# EAGLE design artProject_X (EAGLE 8.6.0)
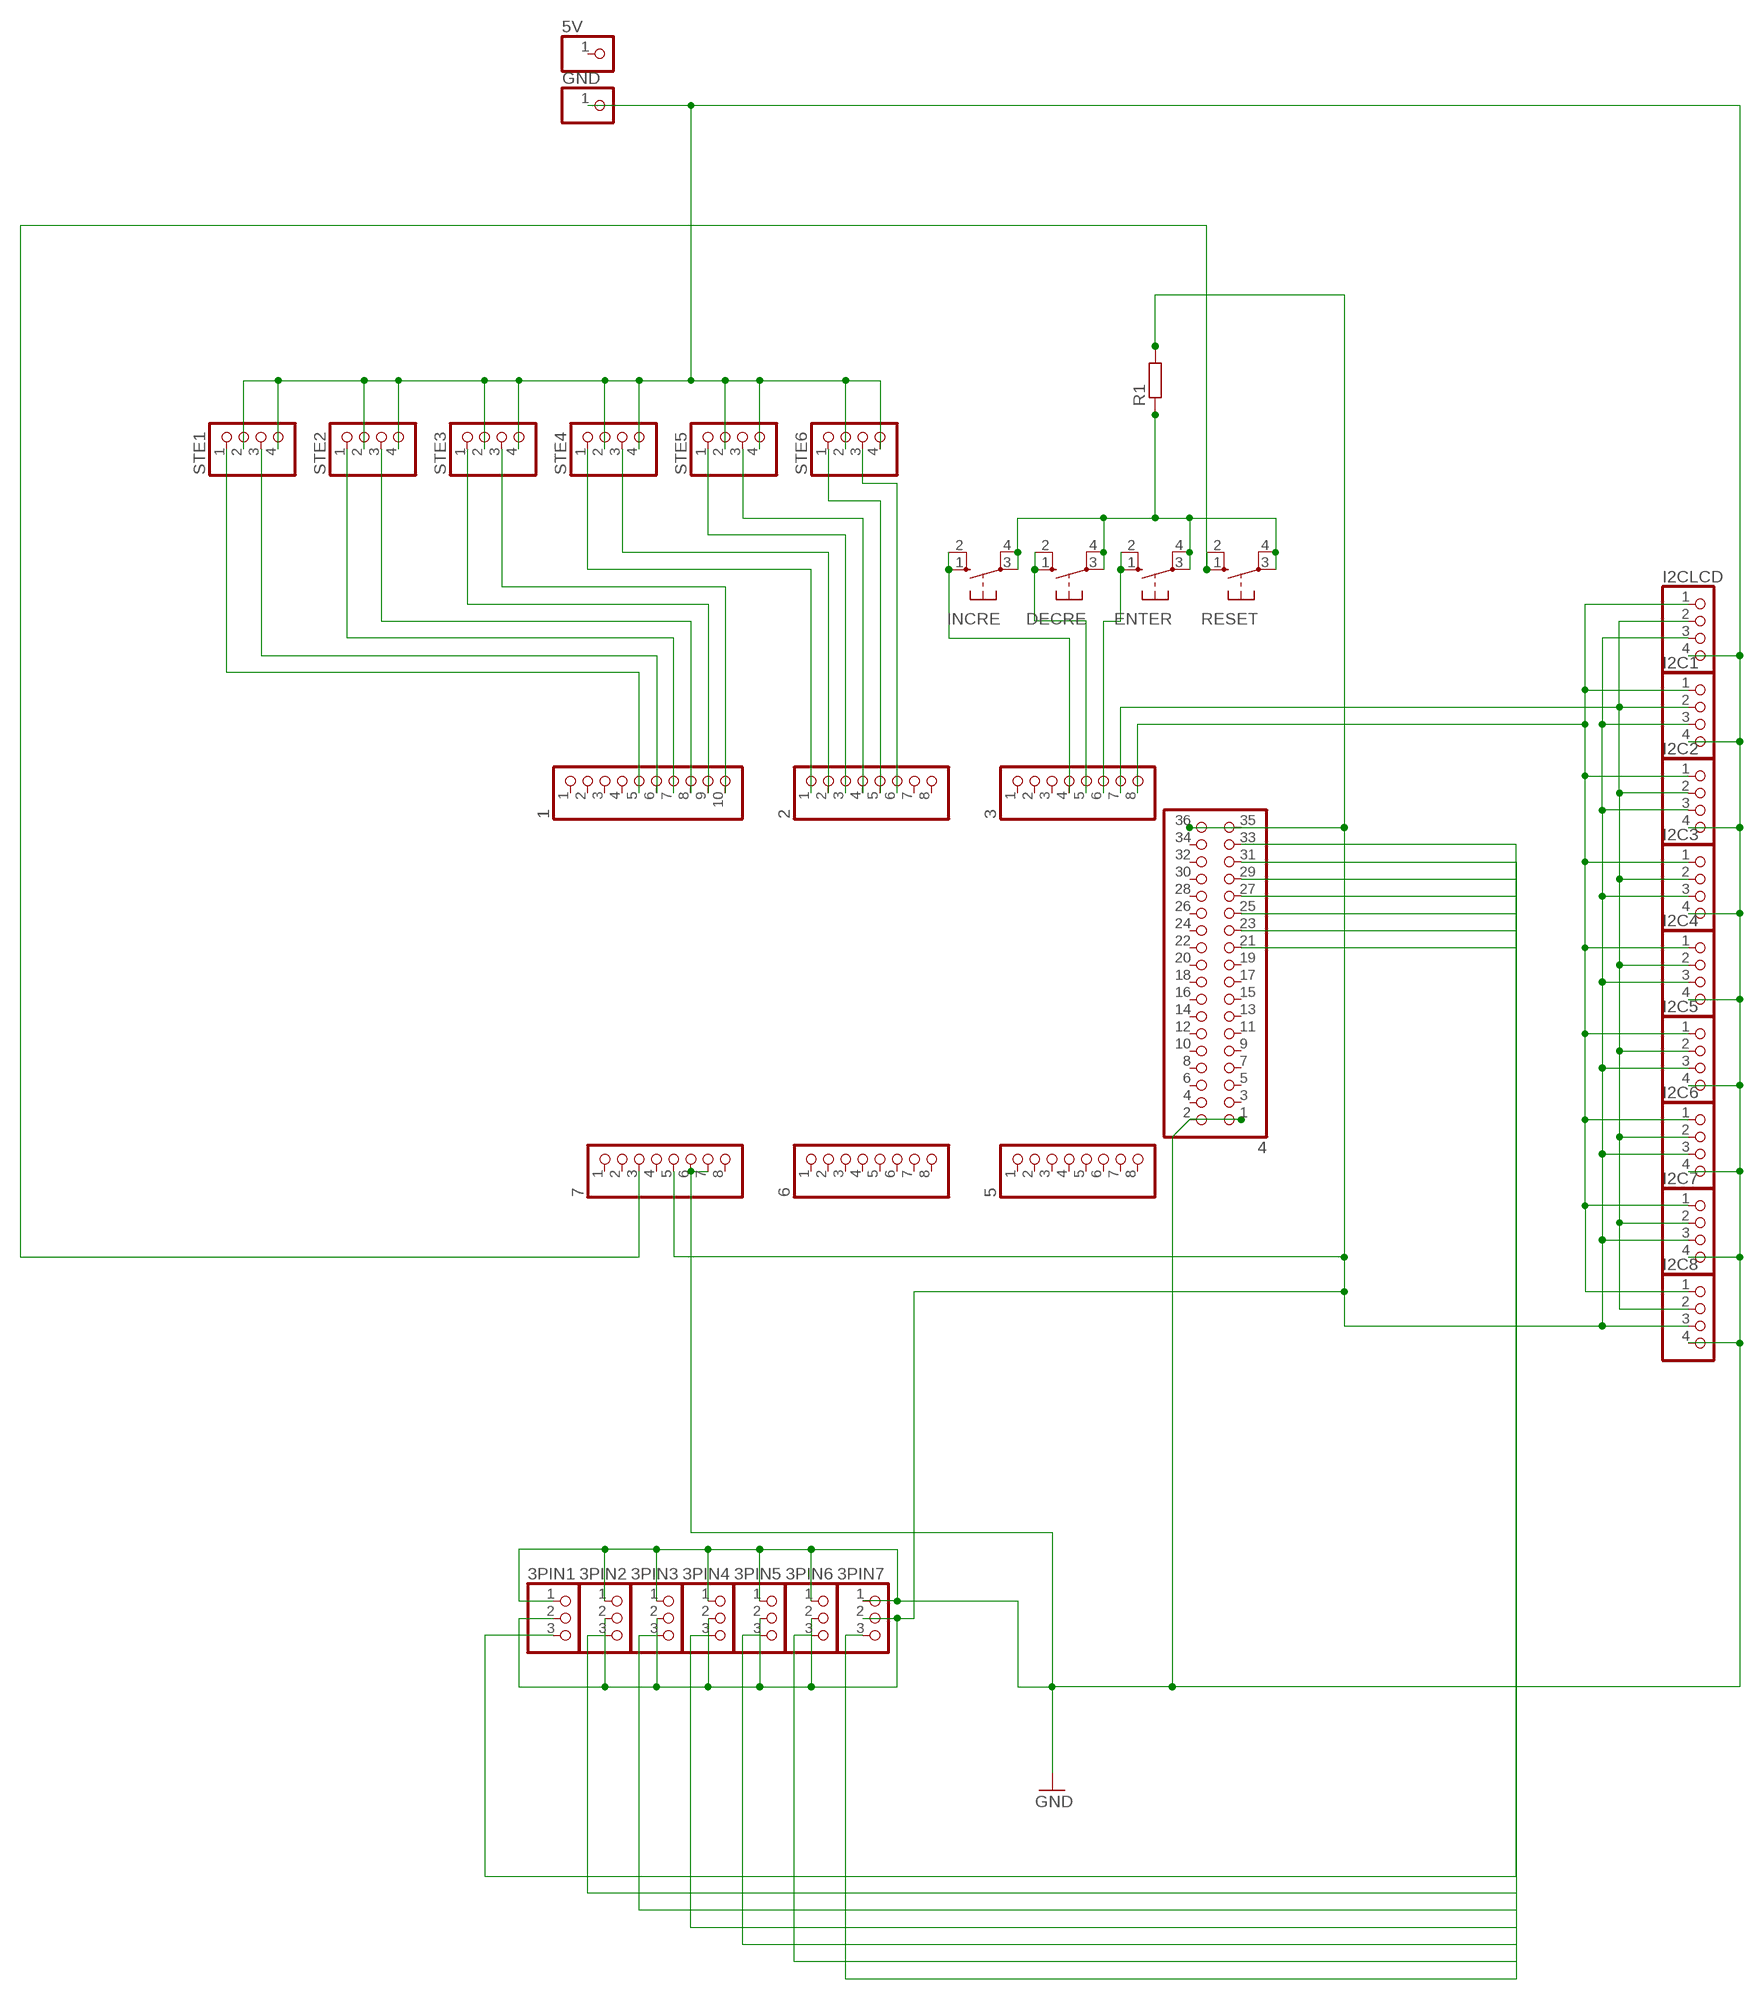
[diagram p0: schematic, sheet 1]

## Parts
1  PINHD-1X10  [1X10]
2  PINHD-1X8  [1X08]
3  PINHD-1X8  [1X08]
3PIN1  PINHD-1X3  [1X03]
3PIN2  PINHD-1X3  [1X03]
3PIN3  PINHD-1X3  [1X03]
3PIN4  PINHD-1X3  [1X03]
3PIN5  PINHD-1X3  [1X03]
3PIN6  PINHD-1X3  [1X03]
3PIN7  PINHD-1X3  [1X03]
4  PINHD-2X18  [2X18]
5  PINHD-1X8  [1X08]
5V  PINHD-1X1  [1X01]
6  PINHD-1X8  [1X08]
7  PINHD-1X8  [1X08]
DECRE  10-XX  [B3F-10XX]
ENTER  10-XX  [B3F-10XX]
GND  PINHD-1X1  [1X01]
I2C1  PINHD-1X4  [1X04]
I2C2  PINHD-1X4  [1X04]
I2C3  PINHD-1X4  [1X04]
I2C4  PINHD-1X4  [1X04]
I2C5  PINHD-1X4  [1X04]
I2C6  PINHD-1X4  [1X04]
I2C7  PINHD-1X4  [1X04]
I2C8  PINHD-1X4  [1X04]
I2CLCD  PINHD-1X4  [1X04]
INCRE  10-XX  [B3F-10XX]
R1  R-EU_0204/7  [0204/7]
RESET  10-XX  [B3F-10XX]
STE1  PINHD-1X4  [1X04]
STE2  PINHD-1X4  [1X04]
STE3  PINHD-1X4  [1X04]
STE4  PINHD-1X4  [1X04]
STE5  PINHD-1X4  [1X04]
STE6  PINHD-1X4  [1X04]

## Nets
GND: 3PIN1.1 3PIN2.1 3PIN3.1 3PIN4.1 3PIN5.1 3PIN6.1 3PIN7.1 4.1 4.2 7.6 7.7 GND.1 I2C1.4 I2C2.4 I2C3.4 I2C4.4 I2C5.4 I2C6.4 I2C7.4 I2C8.4 I2CLCD.4 STE1.2 STE1.4 STE2.2 STE2.4 STE3.2 STE3.4 STE4.2 STE4.4 STE5.2 STE5.4 STE6.2 STE6.4
N$1: 3PIN1.3 4.33
N$2: 3.4 INCRE.1(S) INCRE.2(S1)
N$3: 3PIN2.3 4.31
N$4: 3PIN3.3 4.29
N$5: 3PIN4.3 4.27
N$6: 3PIN5.3 4.25
N$7: 3PIN6.3 4.23
N$8: 3PIN7.3 4.21
N$9: 3.5 DECRE.1(S) DECRE.2(S1)
N$10: 3.6 ENTER.1(S) ENTER.2(S1)
N$11: 7.3 RESET.1(S) RESET.2(S1)
N$12: 2.5 STE6.1
N$13: 2.6 STE6.3
N$14: 2.4 STE5.3
N$15: DECRE.3(P) DECRE.4(P1) ENTER.3(P) ENTER.4(P1) INCRE.3(P) INCRE.4(P1) R1.1 RESET.3(P) RESET.4(P1)
N$16: 2.3 STE5.1
N$17: 2.2 STE4.3
N$18: 2.1 STE4.1
N$19: 1.10 STE3.3
N$20: 1.9 STE3.1
N$21: 1.8 STE2.3
N$22: 1.7 STE2.1
N$23: 1.6 STE1.3
N$24: 1.5 STE1.1
SCL: 3.8 I2C1.1 I2C2.1 I2C3.1 I2C4.1 I2C5.1 I2C6.1 I2C7.1 I2C8.1 I2CLCD.1
SDA: 3.7 I2C1.2 I2C2.2 I2C3.2 I2C4.2 I2C5.2 I2C6.2 I2C7.2 I2C8.2 I2CLCD.2
VCC: 3PIN1.2 3PIN2.2 3PIN3.2 3PIN4.2 3PIN5.2 3PIN6.2 3PIN7.2 4.35 4.36 7.5 I2C1.3 I2C2.3 I2C3.3 I2C4.3 I2C5.3 I2C6.3 I2C7.3 I2C8.3 I2CLCD.3 R1.2
Unconnected: 1.1 1.2 1.3 1.4 2.7 2.8 3.1 3.2 3.3 4.3 4.4 4.5 4.6 4.7 4.8 4.9 4.10 4.11 4.12 4.13 4.14 4.15 4.16 4.17 4.18 4.19 4.20 4.22 4.24 4.26 4.28 4.30 4.32 4.34 5.1 5.2 5.3 5.4 5.5 5.6 5.7 5.8 5V.1 6.1 6.2 6.3 6.4 6.5 6.6 6.7 6.8 7.1 7.2 7.4 7.8

## Library data of the parts
1 = pinhead:PINHD-1X10: PIN HEADER
2 3 5-7 = pinhead:PINHD-1X8: PIN HEADER
3PIN1-3PIN7 = pinhead:PINHD-1X3: PIN HEADER
4 = pinhead:PINHD-2X18: PIN HEADER
5V GND = pinhead:PINHD-1X1: PIN HEADER
DECRE ENTER INCRE RESET = switch-omron:10-XX: OMRON SWITCH; MPN: B3F-1000; OC_FARNELL: 176432; OC_NEWARK: 36M3542
I2C1-I2C8 I2CLCD STE1-STE6 = pinhead:PINHD-1X4: PIN HEADER
R1 = resistor:R-EU_: RESISTOR, European symbol

## Board
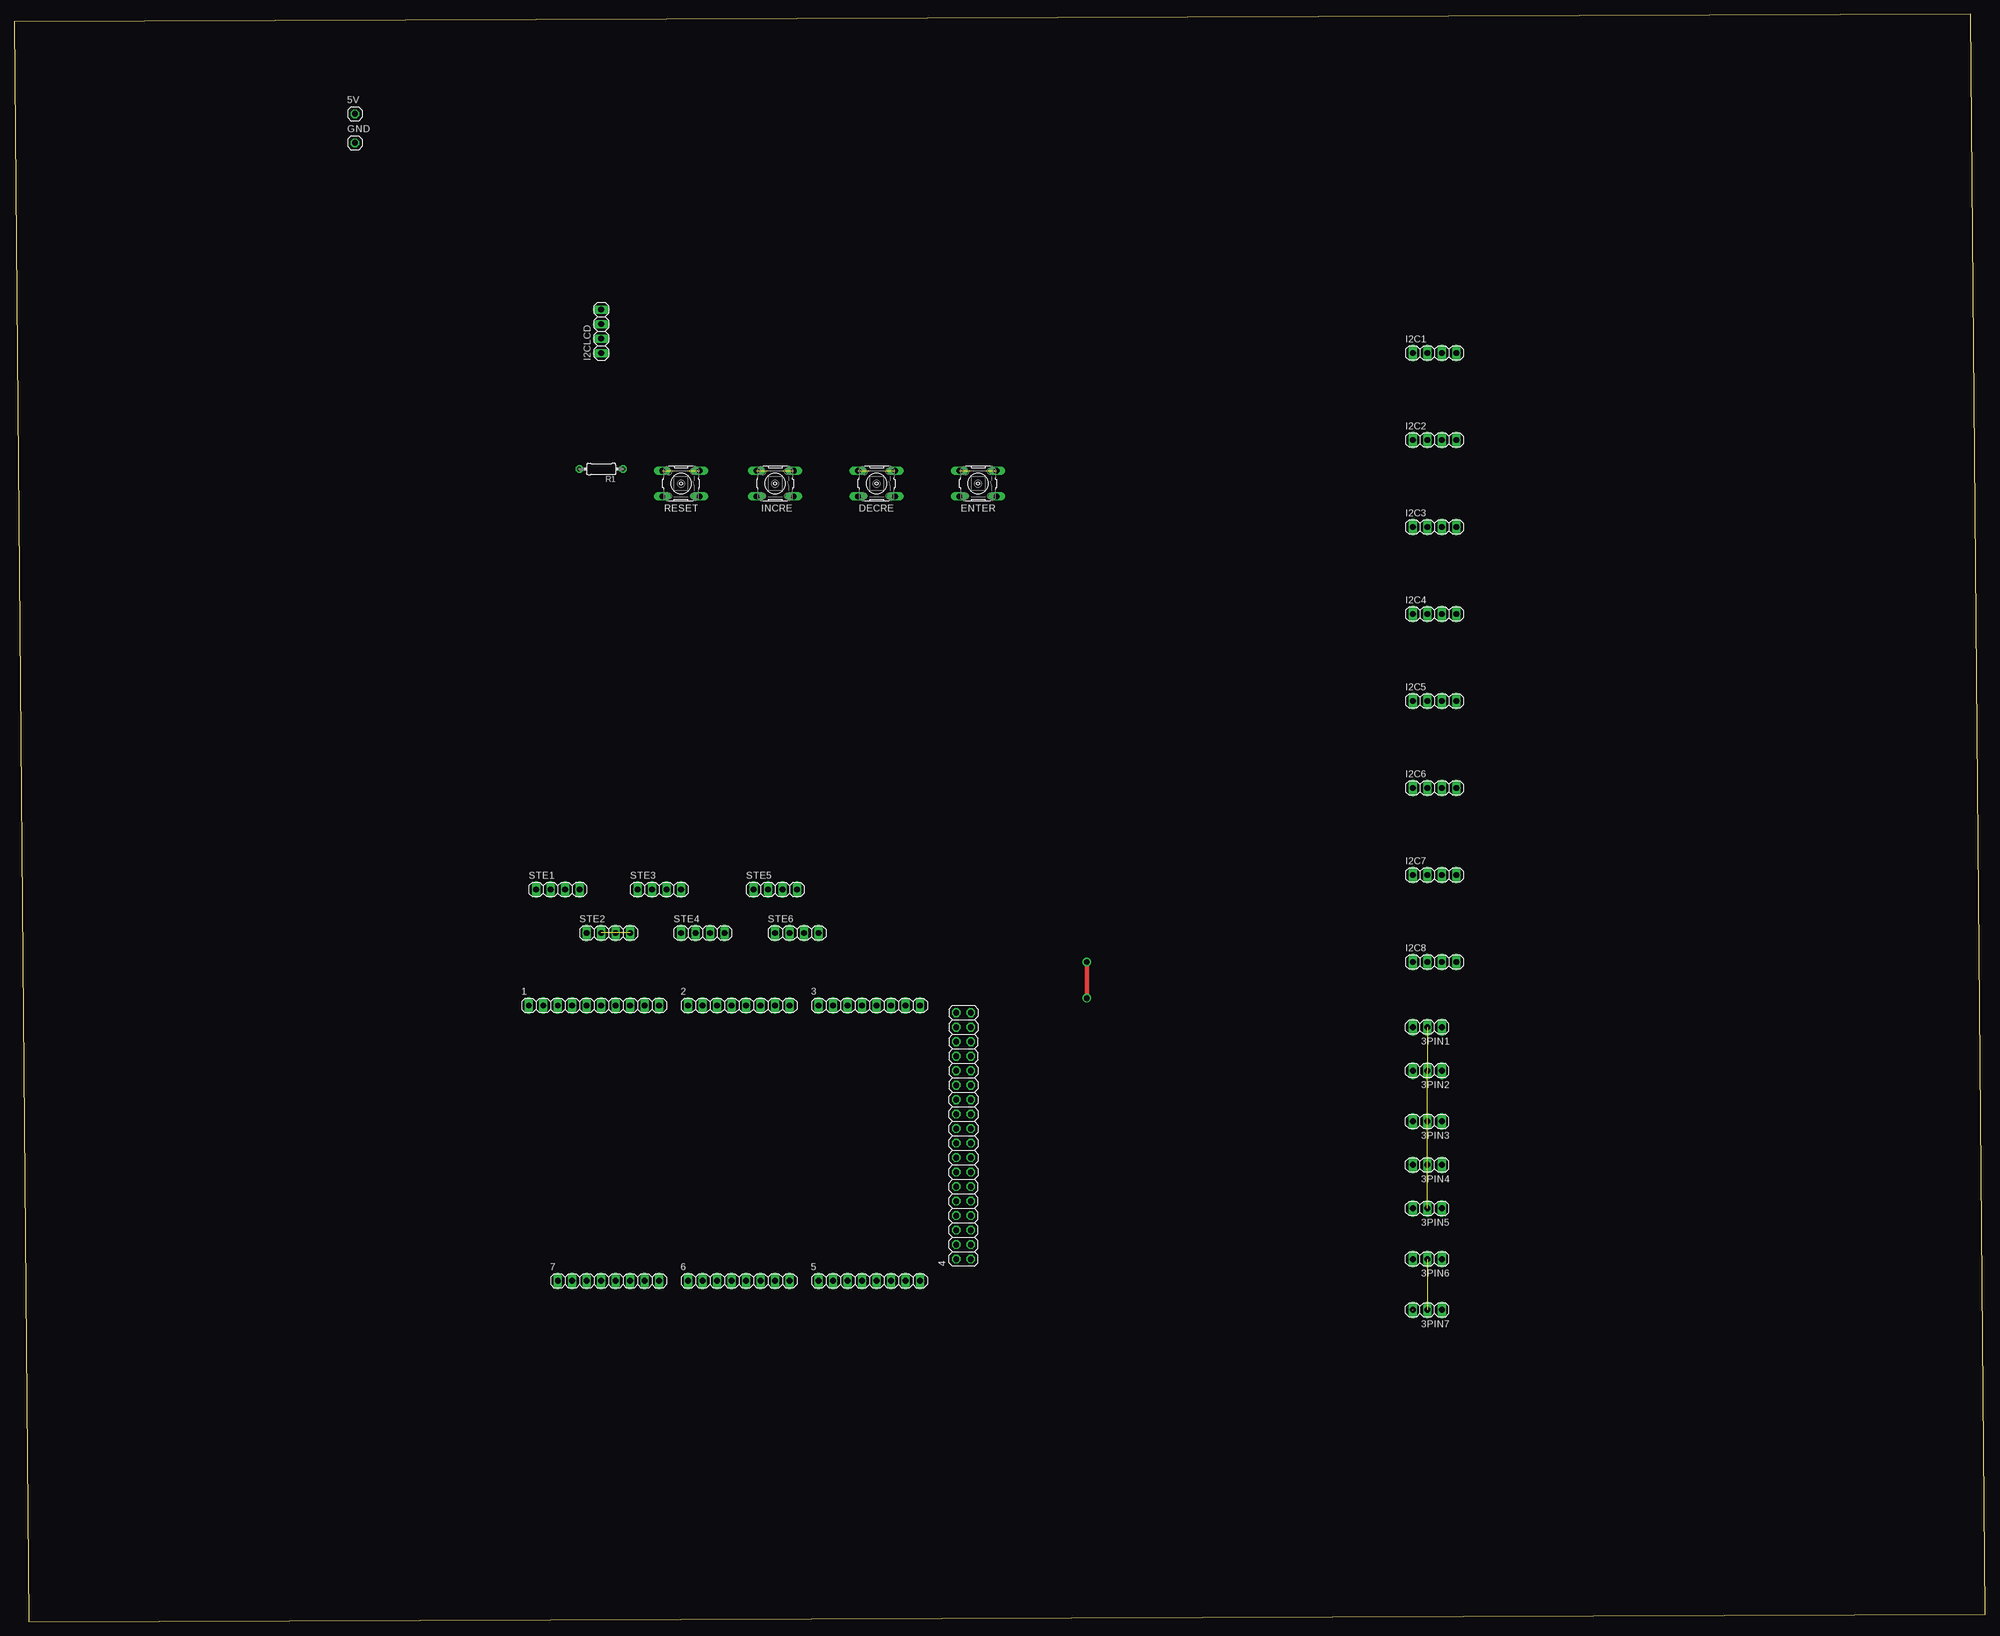
[diagram p1: board, top side]
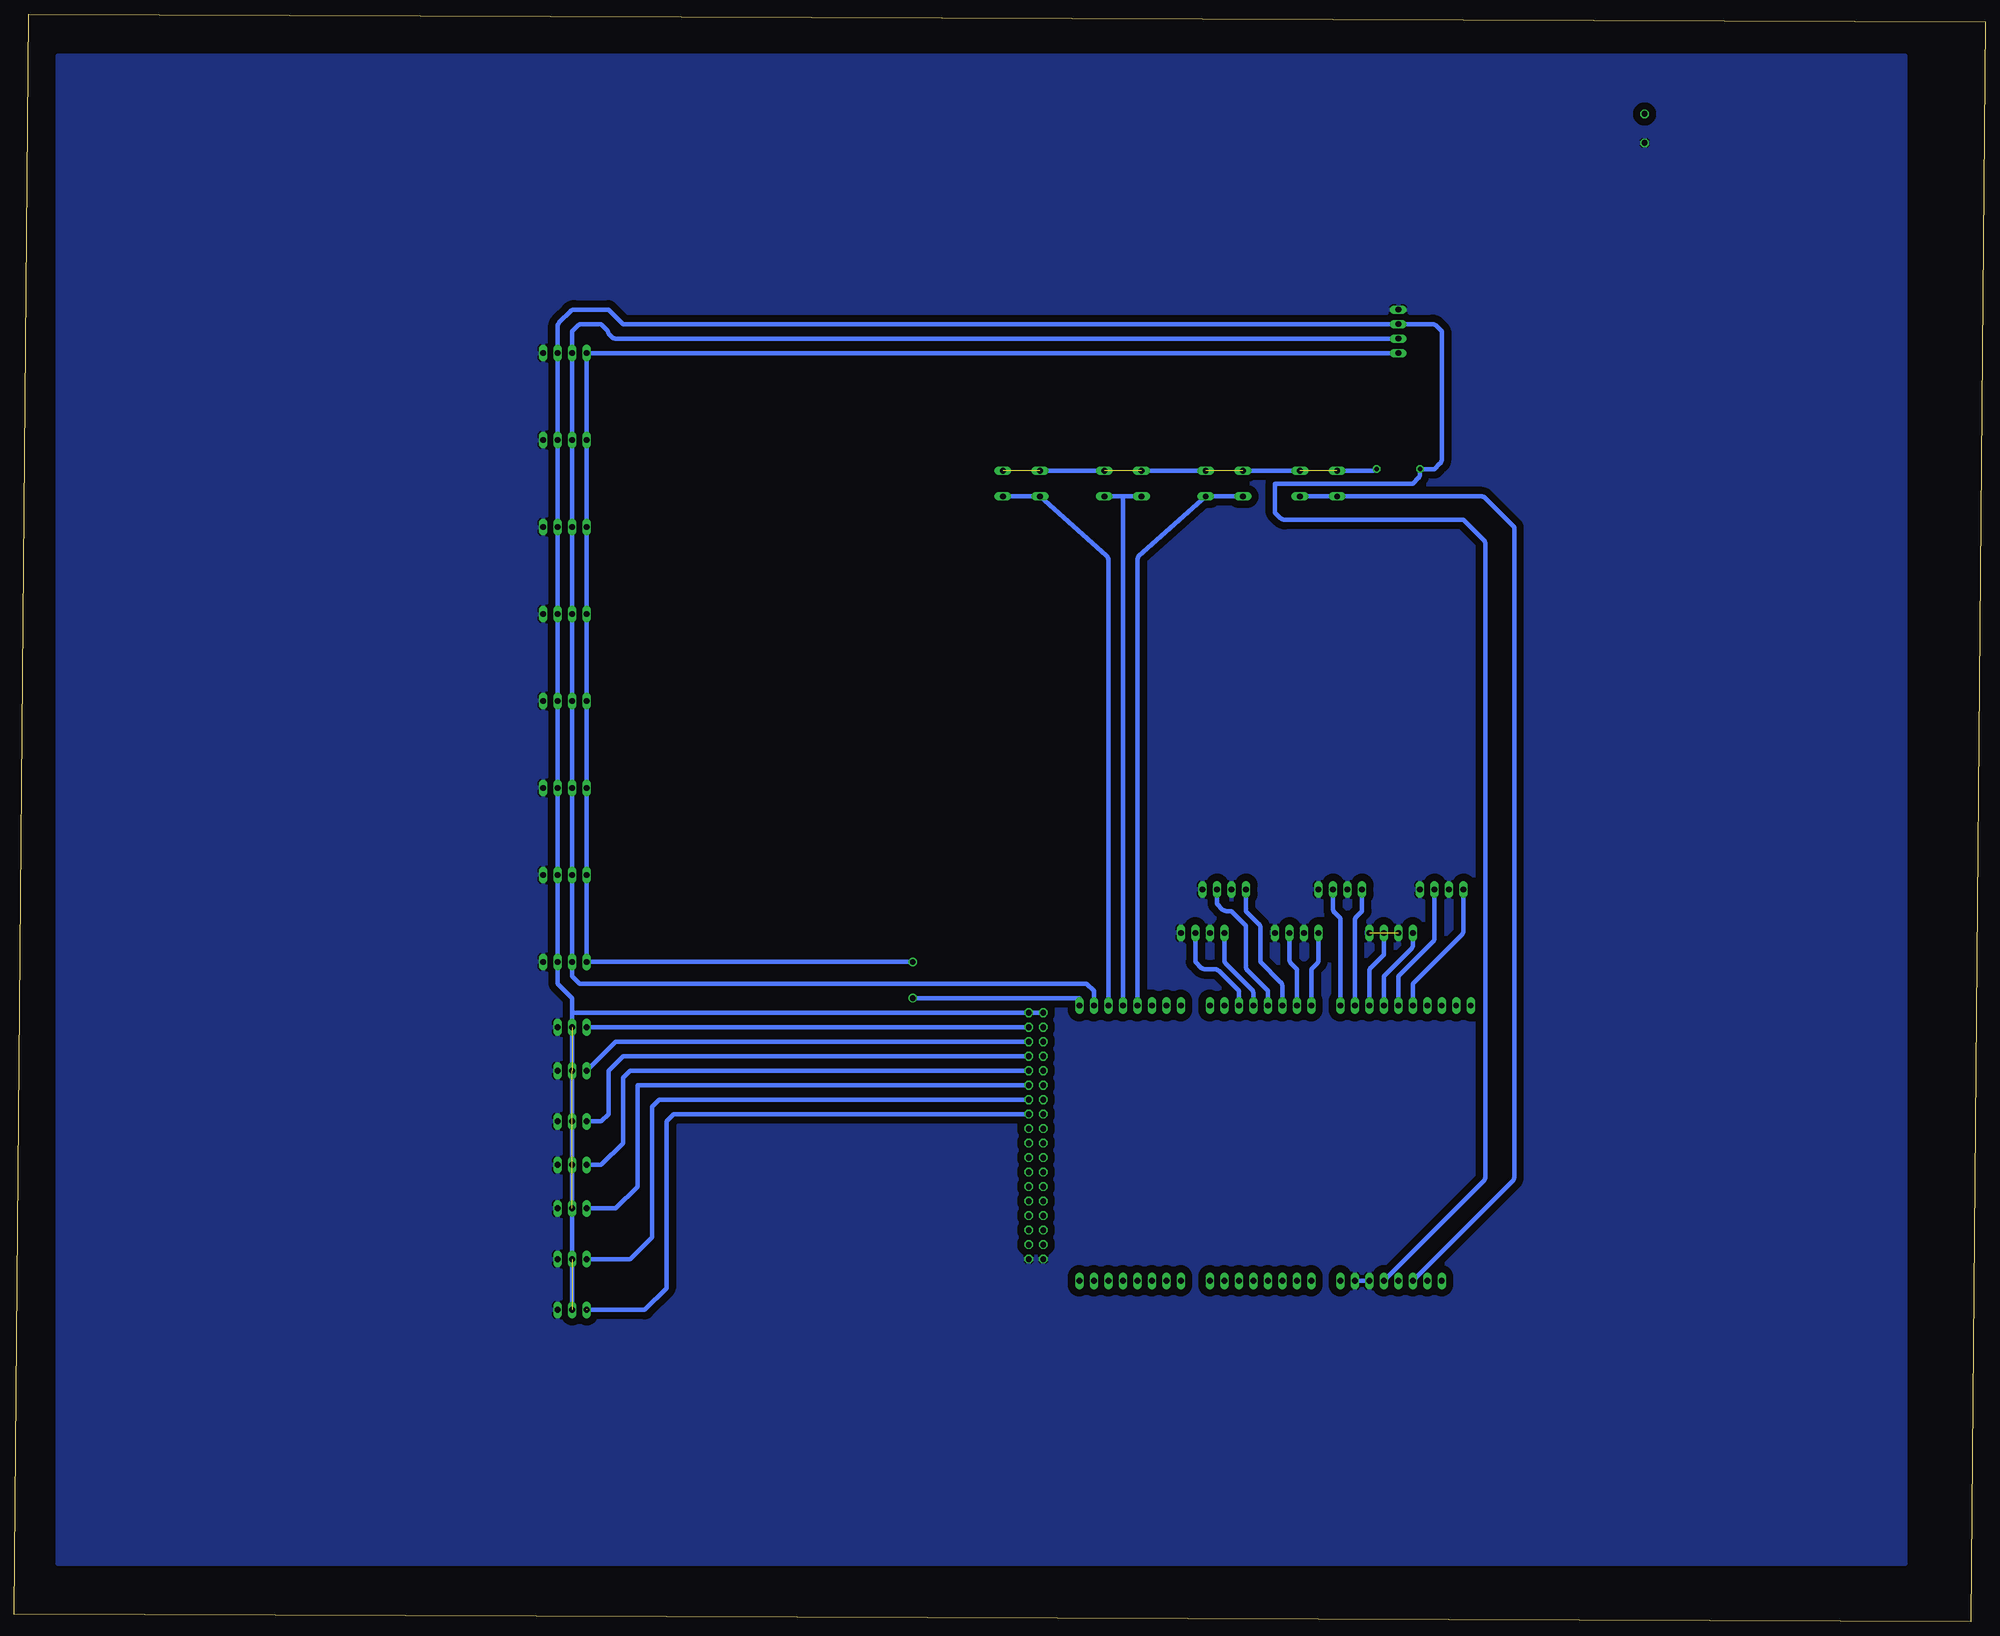
[diagram p2: board, bottom side, seen from below]

Size 345.42 x 281.61 mm. Coordinates in mm from the lower left corner, seen from the top.
Outline: 2.54,0 345.42,1.27 342.88,281.61 0,280.34 2.54,0
Copper layers (1*16): Top 0.035mm / dielectric 1.5mm / Bottom 0.035mm
Design rules "default": minimum track width 6mil, minimum drill 0.35mm, track to track 6mil, track to pad 6mil, pad to pad 6mil, via to via 6mil, smd to smd 6mil, copper to edge 40mil, drill to drill 6mil, minimum pad ring 10mil, minimum via ring 8mil, stop-mask expansion 4mil, vias tented up to drill 0mil, thermal gap 10mil

### Footprints (pad centres in the part's own frame; a part is rotated, then mirrored left to right if it is on the bottom)
1X10 = drill 1.016 long: 1 -11.43,0; 2 -8.89,0; 3 -6.35,0; 4 -3.81,0; 5 -1.27,0; 6 1.27,0; 7 3.81,0; 8 6.35,0; 9 8.89,0; 10 11.43,0
1X08 = drill 1.016 long: 1 -8.89,0; 2 -6.35,0; 3 -3.81,0; 4 -1.27,0; 5 1.27,0; 6 3.81,0; 7 6.35,0; 8 8.89,0
1X03 = drill 1.016 long: 1 -2.54,0; 2 0,0; 3 2.54,0
2X18 = drill 1.016 octagon: 1 -21.59,-1.27; 2 -21.59,1.27; 3 -19.05,-1.27; 4 -19.05,1.27; 5 -16.51,-1.27; 6 -16.51,1.27; 7 -13.97,-1.27; 8 -13.97,1.27; 9 -11.43,-1.27; 10 -11.43,1.27; 11 -8.89,-1.27; 12 -8.89,1.27; 13 -6.35,-1.27; 14 -6.35,1.27; 15 -3.81,-1.27; 16 -3.81,1.27; 17 -1.27,-1.27; 18 -1.27,1.27; 19 1.27,-1.27; 20 1.27,1.27; 21 3.81,-1.27; 22 3.81,1.27; 23 6.35,-1.27; 24 6.35,1.27; 25 8.89,-1.27; 26 8.89,1.27; 27 11.43,-1.27; 28 11.43,1.27; 29 13.97,-1.27; 30 13.97,1.27; 31 16.51,-1.27; 32 16.51,1.27; 33 19.05,-1.27; 34 19.05,1.27; 35 21.59,-1.27; 36 21.59,1.27
1X01 = drill 1.016 octagon: 1 0,0
B3F-10XX = drill 1.016 long: 1 -3.251,2.261; 2 3.251,2.261; 3 -3.251,-2.261; 4 3.251,-2.261
1X04 = drill 1.016 long: 1 -3.81,0; 2 -1.27,0; 3 1.27,0; 4 3.81,0
0204/7 = drill 0.813 octagon: 1 -3.81,0; 2 3.81,0

### Placement (x,y rotation side)
1  101.6,107.95 0 top
2  127,107.95 0 top
3  149.86,107.95 0 top
3PIN1  247.65,104.14 180 top
3PIN2  247.65,96.52 180 top
3PIN3  247.65,87.63 180 top
3PIN4  247.65,80.01 180 top
3PIN5  247.65,72.39 180 top
3PIN6  247.65,63.5 180 top
3PIN7  247.65,54.61 180 top
4  166.37,85.09 90 top
5  149.86,59.69 0 top
5V  59.69,264.16 0 top
6  127,59.69 0 top
7  104.14,59.69 0 top
DECRE  151.13,199.39 180 top
ENTER  168.91,199.39 180 top
GND  59.69,259.08 0 top
I2C1  248.92,222.25 0 top
I2C2  248.92,207.01 0 top
I2C3  248.92,191.77 0 top
I2C4  248.92,176.53 0 top
I2C5  248.92,161.29 0 top
I2C6  248.92,146.05 0 top
I2C7  248.92,130.81 0 top
I2C8  248.92,115.57 0 top
I2CLCD  102.87,226.06 90 top
INCRE  133.35,199.39 180 top
R1  102.87,201.93 180 top
RESET  116.84,199.39 180 top
STE1  95.25,128.27 0 top
STE2  104.14,120.65 0 top
STE3  113.03,128.27 0 top
STE4  120.65,120.65 0 top
STE5  133.35,128.27 0 top
STE6  137.16,120.65 0 top

### Tracks (layer width: path | path; a pad name or v marks a point on that pad's centre or on a via)
GND  (1 unrouted)
  Bottom 0.813: 7.6 7.7
  pour Bottom (isolate 1.27): 337.82,274.32 13.97,274.32 13.97,10.16 337.82,10.16
N$1
  Bottom 0.813: 4.33 3PIN1.3
N$2
  Bottom 0.813: INCRE.2 INCRE.1 148.3,186.7 arc-45 148.59,186 3.4
N$3
  Bottom 0.813: 4.31 240.03,101.6 3PIN2.3
N$4
  Bottom 0.813: 4.29 238.76,99.06 241.3,96.52 241.3,88.9 242.57,87.63 3PIN3.3
N$5
  Bottom 0.813: 4.27 237.49,96.52 238.76,95.25 238.76,83.82 242.57,80.01 3PIN4.3
N$6
  Bottom 0.813: 3PIN5.3 240.03,72.39 236.22,76.2 236.22,93.98 4.25
N$7
  Bottom 0.813: 4.23 232.41,91.44 233.68,90.17 233.68,67.31 237.49,63.5 242.57,63.5 3PIN6.3
N$8  (1 unrouted)
  Bottom 0.813: 245.06,54.61 234.95,54.61 231.14,58.42 231.14,87.63 229.87,88.9 4.21
N$9
  Bottom 0.813: DECRE.2 151.13,197.13 | 151.13,197.13 DECRE.1 | 151.13,197.13 3.5
N$10
  Bottom 0.813: ENTER.1 ENTER.2 153.96,186.7 arc45 153.67,186 3.6
N$11
  Bottom 0.813: RESET.1 RESET.2 88.32,197.13 arc45 87.62,196.84 82.55,191.77 82.55,77.88 arc45 82.84,77.18 7.3
N$12
  Bottom 0.813: 2.5 128.27,110.08 arc-45 128.56,110.78 133.06,115.28 arc45 133.35,115.98 STE6.1
N$13
  Bottom 0.813: STE6.3 138.43,115.57 137.45,114.59 arc-45 136.75,114.3 135.03,114.3 arc45 134.33,114.01 130.81,110.49 2.6
N$14
  Bottom 0.813: STE5.3 134.62,125.73 133.64,124.75 arc-45 132.94,124.46 132.08,124.46 129.54,121.92 129.54,114.71 arc-45 129.25,114.01 125.73,110.49 2.4
N$15  (4 unrouted)
  Bottom 0.813: INCRE.3 DECRE.4 | DECRE.3 ENTER.4 | R1.1 arc45 107.36,201.65 RESET.4 | RESET.3 INCRE.4
N$16
  Bottom 0.813: 2.3 123.19,111.35 arc-45 123.48,112.05 127,115.57 127,121.51 arc-45 127.29,122.21 129.54,124.46 STE5.1
N$17
  Bottom 0.813: STE4.3 121.92,115.98 arc-45 121.63,115.28 120.65,114.3 2.2
N$18
  Bottom 0.813: STE4.1 116.84,115.98 arc45 117.13,115.28 118.11,114.3 2.1
N$19
  Bottom 0.813: STE3.3 114.3,124.87 arc-45 114.01,124.17 113.03,123.19 1.10
N$20
  Bottom 0.813: 1.9 110.49,122.78 arc45 110.2,123.48 109.22,124.46 STE3.1
N$21
  Bottom 0.813: STE2.3 105.41,116.84 107.66,114.59 arc-45 107.95,113.89 1.8
N$22
  Bottom 0.813: STE2.1 100.33,118.52 arc45 100.62,117.82 105.41,113.03 1.7
N$23
  Bottom 0.813: STE1.3 96.52,119.79 arc45 96.81,119.09 102.87,113.03 1.6
N$24
  Bottom 0.813: 1.5 100.33,111.76 91.73,120.36 arc-45 91.44,121.06 STE1.1
SCL  (via drill 1 pad 1.3)
  Top 0.813: v187.96,109.22 v187.96,115.57
  Bottom 0.813: 3.8 158.75,109.22 v187.96,109.22 | v187.96,115.57 I2C8.1 I2C7.1 I2C6.1 I2C5.1 I2C4.1 I2C3.1 I2C2.1 I2C1.1 I2CLCD.1
SDA
  Bottom 0.813: 3.7 156.21,110.49 157.48,111.76 246.38,111.76 247.65,113.03 I2C8.2 I2C7.2 I2C6.2 I2C5.2 I2C4.2 I2C3.2 I2C2.2 I2C1.2 247.65,226.06 246.67,227.04 arc45 245.97,227.33 242.57,227.33 241.59,226.35 arc45 241.3,225.65 240.74,225.08 arc-45 240.03,224.79 I2CLCD.2
VCC  (5 unrouted)
  Bottom 0.813: 4.36 4.35 247.65,106.68 | 3PIN7.2 3PIN1.2 247.65,106.68 | 247.65,106.68 247.65,109.22 250.19,111.76 I2C8.3 I2C7.3 I2C6.3 I2C5.3 I2C4.3 I2C3.3 I2C2.3 I2C1.3 250.19,226.92 arc45 249.9,227.62 247.94,229.58 arc45 247.24,229.87 241.3,229.87 238.76,227.33 I2CLCD.3 96.93,227.33 arc45 96.23,227.04 95.25,226.06 95.25,203.61 arc45 95.54,202.91 96.52,201.93 R1.2 99.06,201.07 arc45 99.35,200.37 100.33,199.39 124.46,199.39 124.46,194.31 123.48,193.33 arc-45 122.78,193.04 91.44,193.04 87.92,189.52 arc45 87.63,188.82 87.63,77.88 arc45 87.92,77.18 7.5